# Altium schematic sheet Sheet_Receive.SchDoc
size A
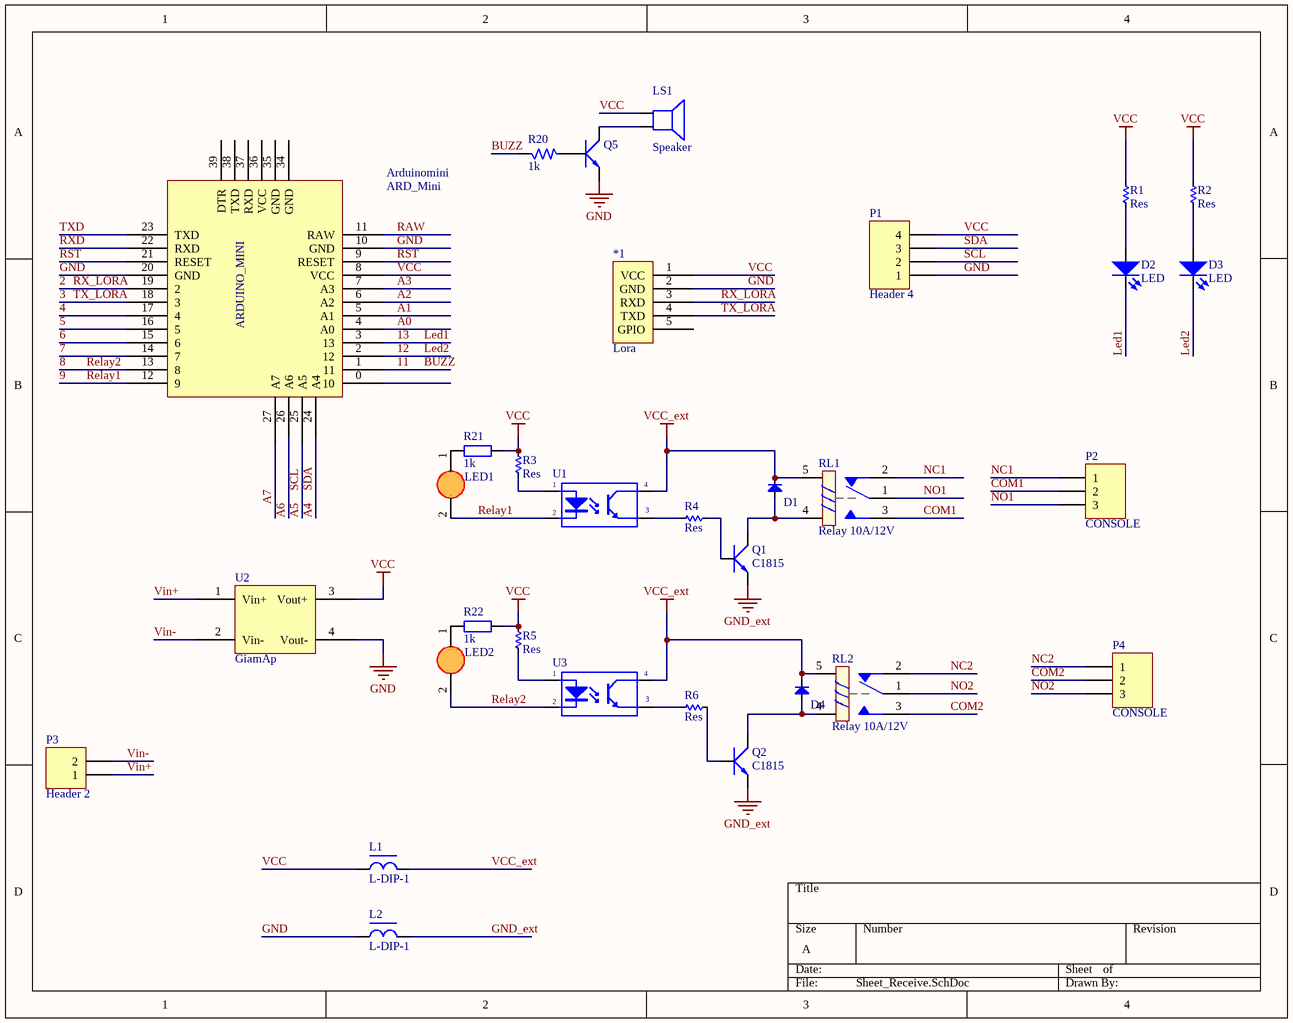
[diagram p0: Sheet_Receive.SchDoc]

## Parts
*1  Lora  [Lora]
Arduinomini  ARD_Mini  [Arduino_mini]
D1  Diode  [DIO-1A-SMALL]  (value not drawn)
D2  LED  [LED-5 GRe]
D3  LED  [LED-5TRED]
D4  Diode  [DIO-1A-SMALL]  (value not drawn)
L1  L-DIP-1  [L-DIP-M-6.0]
L2  L-DIP-1  [L-DIP-M-6.0]
LED1  LED3  [LED3mm]  (value not drawn)
LED2  LED3  [LED3mm]  (value not drawn)
LS1  Speaker  [SPEAKER]
P1  Header 4  [HEADER 4PIN]
P2  CONSOLE  [HED3T]
P3  Header 2  [HED2T]
P4  CONSOLE  [HED3T]
Q1  C1815  [QTO-92]
Q2  C1815  [QTO-92]
Q5  C1815  [QTO-92]  (value not drawn)
R1  Res  [RES-1/4W]
R2  Res  [RES-1/4W]
R3  Res  [RES-1/4W]
R4  Res  [RES-1/4W]
R5  Res  [RES-1/4W]
R6  Res  [RES-1/4W]
R20  1k  [R1/4W]
R21  1k  [R1/4W]
R22  1k  [R1/4W]
RL1  Relay 10A/12V  [RELAY 5]
RL2  Relay 10A/12V  [RELAY 5]
U1  PC817  [DIP4/W.300]  (value not drawn)
U2  GiamAp  [DC-DC MP1584]
U3  PC817  [DIP4/W.300]  (value not drawn)

## Nets
GND: *1.2(GND) Arduinomini.10(GND) Arduinomini.20(GND) L2.1 P1.1 Q5.1(E) U2.4(Vout-)
GND_ext: L2.2 Q1.1(E) Q2.1(E)
VCC: *1.1(VCC) Arduinomini.8(VCC) L1.1 LS1.1 P1.4 R1.2 R2.2 R3.1 R5.1 R21.2 R22.2 U2.3(Vout+)
VCC_ext: D1.2(K) D4.2(K) L1.2 RL1.5 RL2.5 U1.4(C) U3.4(C)
2: *1.3(RXD) Arduinomini.19(2)  [also labelled RX_LORA]
3: *1.4(TXD) Arduinomini.18(3)  [also labelled TX_LORA]
4: Arduinomini.17(4)
5: Arduinomini.16(5)
6: Arduinomini.15(6)
7: Arduinomini.14(7)
8: Arduinomini.13(8) LED2.2(K) U3.2(K)  [also labelled Relay2]
9: Arduinomini.12(9) LED1.2(K) U1.2(K)  [also labelled Relay1]
11: Arduinomini.1(11) R20.1  [also labelled BUZZ]
12: Arduinomini.2(12) D3.2  [also labelled Led2]
13: Arduinomini.3(13) D2.2  [also labelled Led1]
A0: Arduinomini.4(A0)
A1: Arduinomini.5(A1)
A2: Arduinomini.6(A2)
A3: Arduinomini.7(A3)
A4: Arduinomini.24(A4) P1.3  [also labelled SDA]
A5: Arduinomini.25(A5) P1.2  [also labelled SCL]
A6: Arduinomini.26(A6)
A7: Arduinomini.27(A7)
COM1: P2.2 RL1.3
COM2: P4.2 RL2.3
NC1: P2.1 RL1.2
NC2: P4.1 RL2.2
NO1: P2.3 RL1.1
NO2: P4.3 RL2.1
RAW: Arduinomini.11(RAW)
RST: Arduinomini.9(RESET) Arduinomini.21(RESET)
RXD: Arduinomini.22(RXD)
TXD: Arduinomini.23(TXD)
Vin+: P3.1 U2.1(Vin+)
Vin-: P3.2 U2.2(Vin-)
NetD1_1: D1.1(A) Q1.2(C) RL1.4
NetD2_1: D2.1 R1.1
NetD3_1: D3.1 R2.1
NetD4_1: D4.1(A) Q2.2(C) RL2.4
NetLED1_1: LED1.1(A) R21.1
NetLED2_1: LED2.1(A) R22.1
NetLS1_2: LS1.2 Q5.2(C)
NetQ1_3: Q1.3(B) R4.2
NetQ2_3: Q2.3(B) R6.2
NetQ5_3: Q5.3(B) R20.2
NetR3_2: R3.2 U1.1(A)
NetR4_1: R4.1 U1.3(E)
NetR5_2: R5.2 U3.1(A)
NetR6_1: R6.1 U3.3(E)

Not connected (* = marked no-connect by the designer): *1 5(GPIO); Arduinomini 0(10) 34(GND) 35(GND) 36(VCC) 37(RXD) 38(TXD) 39(DTR)

## Notes on the sheet
- (in symbol Arduino_mini) ARDUINO_MINI

## Library data of the parts
Arduinomini = Arduino_mini
D1 D4 = Diode: Default Diode; Code - JEDEC: DO-214-AB; Value: 1N5007; Published: 8-Jun-2000; Revision: July-2002: Re-released for DXP Platform.; Publisher: Altium Limited
D2 D3 = LED: LED Single; Value: LED 3 ly Single Colour
L1 L2 = L-DIP-1: Inductor; Value: 150 mH
LED1 LED2 = LED 3mm
LS1 = Speaker: Loudspeaker; Published: 24-Mar-1999; LatestRevisionDate: 17-Jul-2002; LatestRevisionNote: Re-released for DXP Platform.; PackageReference: PIN2; Publisher: Altium Limited
P1 = Header 4: Header, 4-Pin; LatestRevisionDate: 17-Jul-2002; LatestRevisionNote: Re-released for DXP Platform.; Publisher: Altium Limited
P2 P4 = Header 3: Header, 3-Pin; LatestRevisionDate: 17-Jul-2002; LatestRevisionNote: Re-released for DXP Platform.; Publisher: Altium Limited
P3 = Header 2: Header, 2-Pin; LatestRevisionDate: 17-Jul-2002; LatestRevisionNote: Re-released for DXP Platform.; Publisher: Altium Limited
Q1 Q2 Q5 = C1815: NPN 600mW, ECB; Value: C1815
R1-R6 = Res: Manufacturer: Generic Components; Class: Passive; SubClass: R; Published: 08/06/2000; Publisher: Altium Hobart Technology Centre
R20 = Res
R21 R22 = R1/4W: Resistor 1/4W; Value: R1/4W - 1K
RL1 RL2 = Relay 5: Relay SPDT,10A - 12VDC 5 Pin; Value: Relay SPDT, 10A, 12V
U1 U3 = PC817: Single Opto; Value: PC817
U2 = DC-DC 7-26 -> 5